# Altium schematic sheet 15-DDR4 DEVICES.SchDoc
size 513 x 386 mm
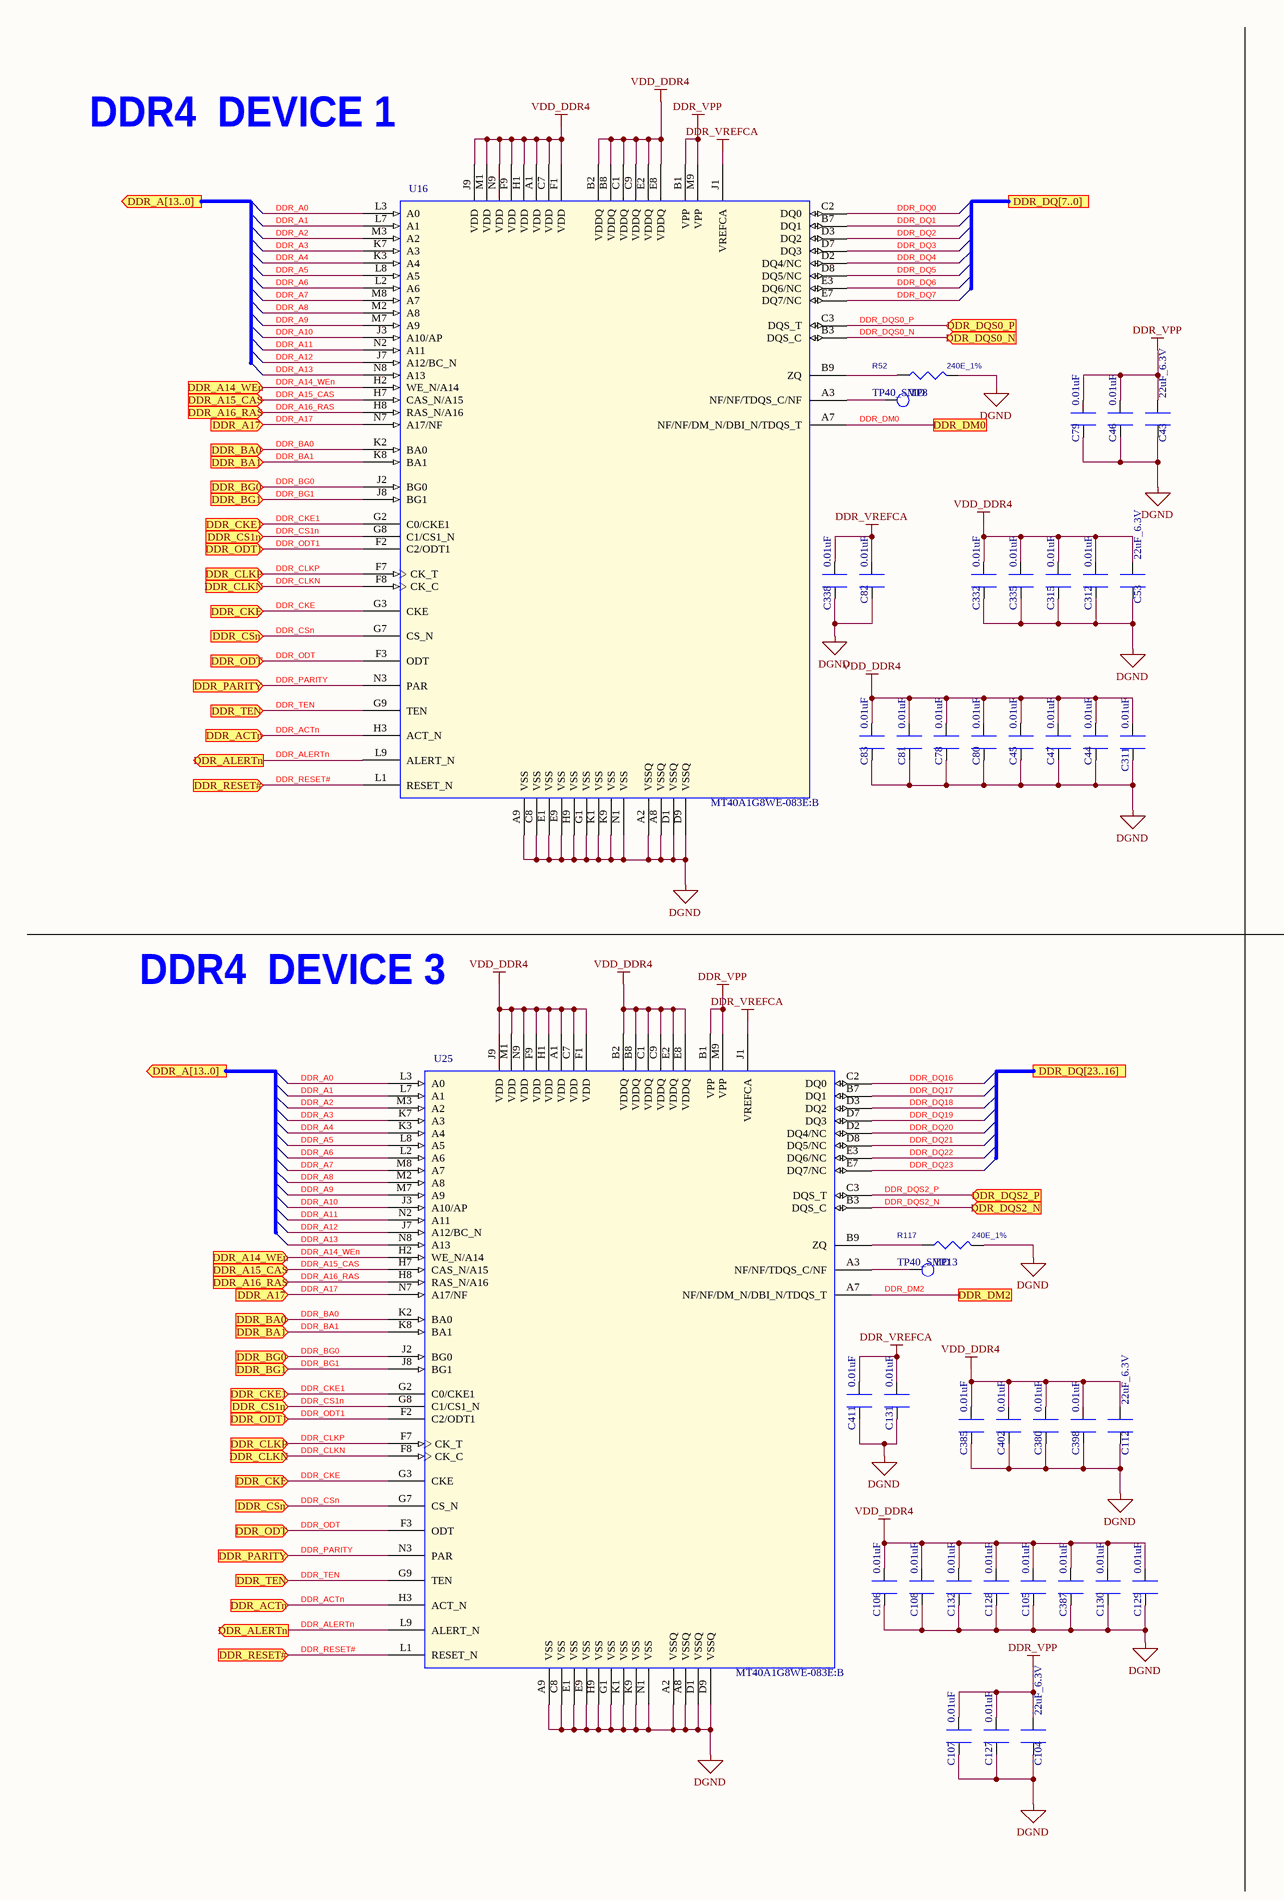
[diagram p0: 15-DDR4 DEVICES.SchDoc, left]
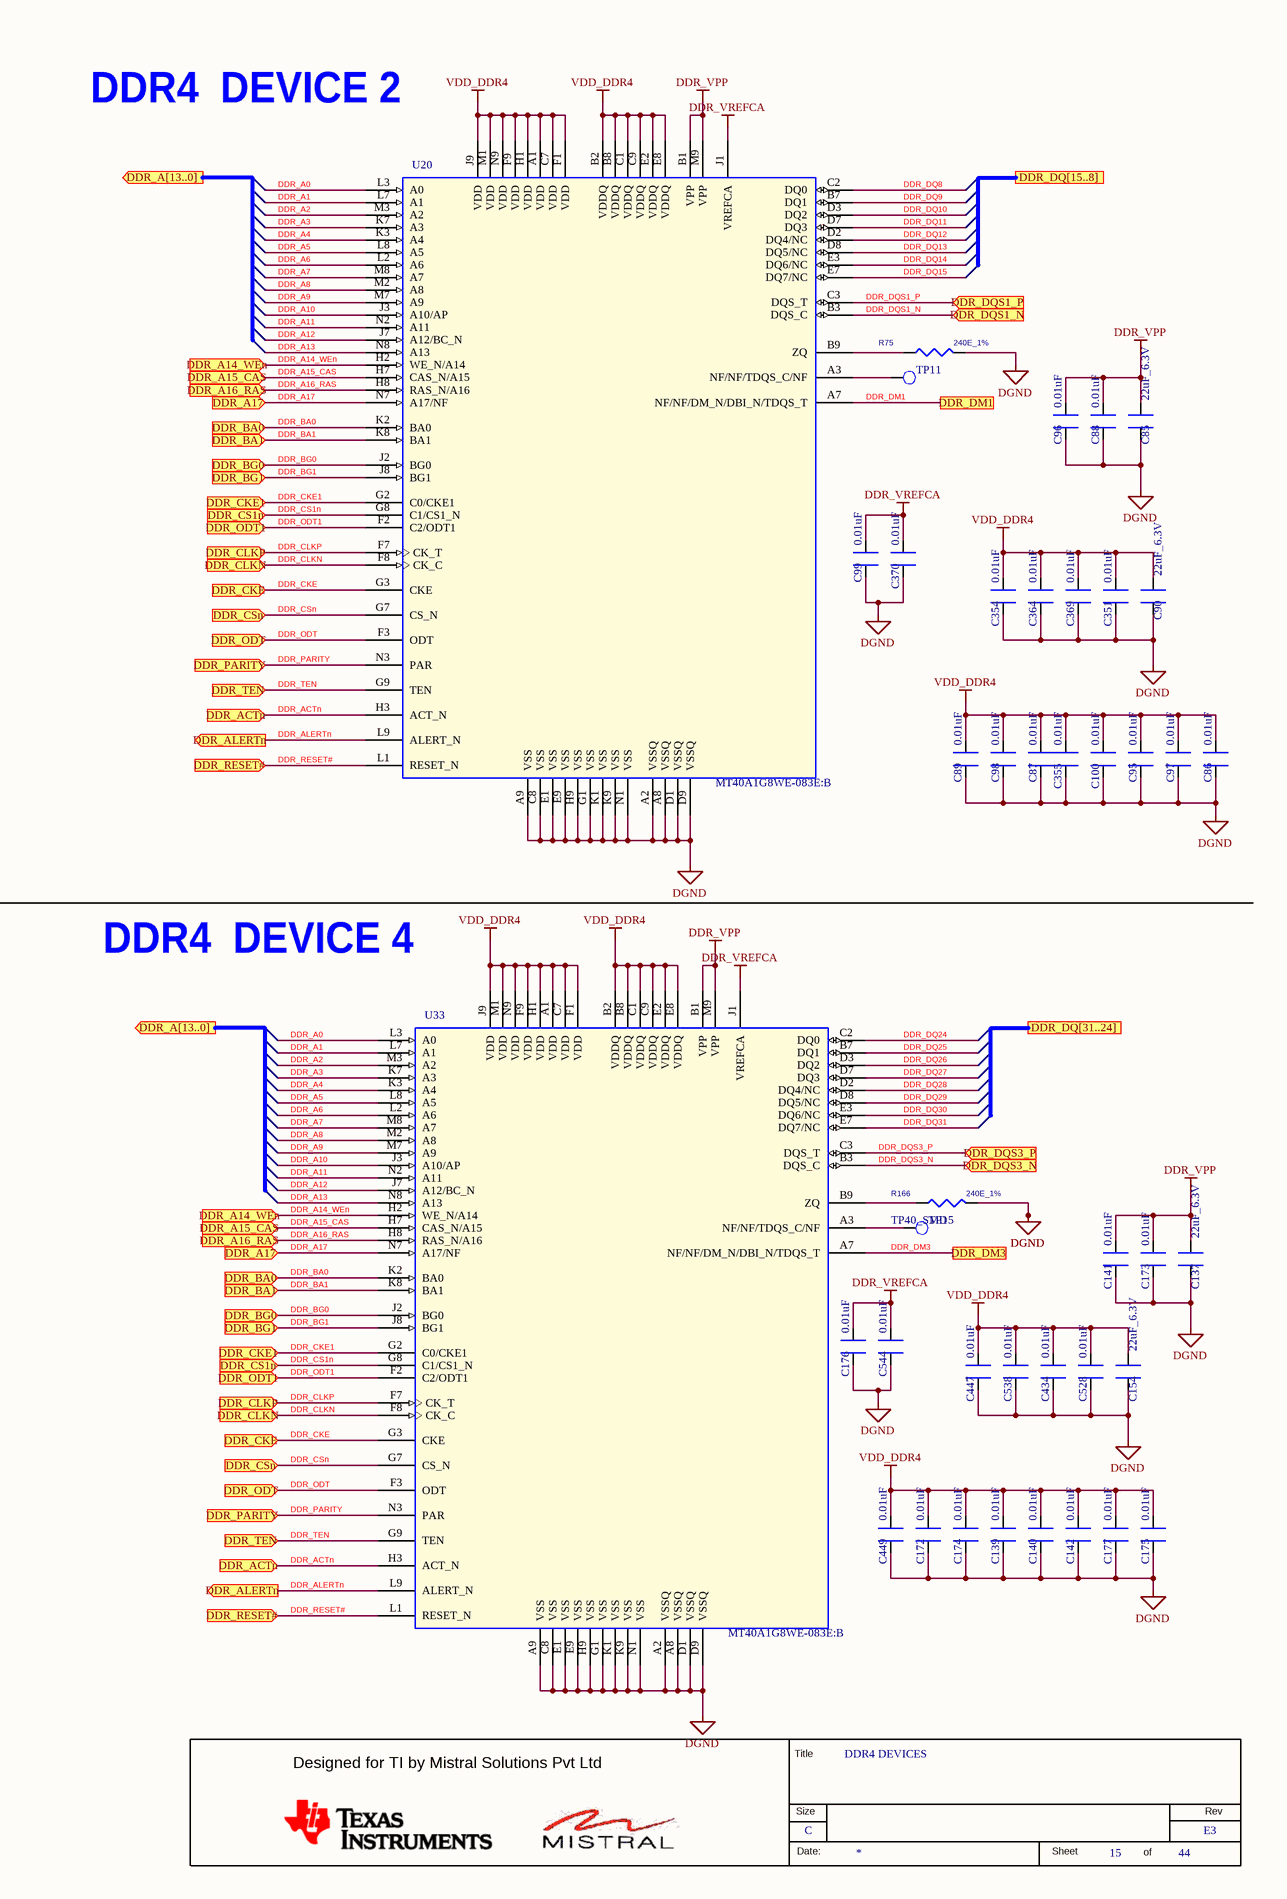
[diagram p1: 15-DDR4 DEVICES.SchDoc, right]

## Parts
*  RevCode: E3  Title: DDR4 DEVICES  Page Size: C  Page Number: 15  Page Count: 44  (hidden comment: MISTRAL_TITLEBLK_CSIZE)  (graphical)
C43  22uF_6.3V  [CAP0603]
C44  0.01uF  [CAP0201_0-5]
C45  0.01uF  [CAP0201_0-5]
C46  0.01uF  [CAP0201_0-5]
C47  0.01uF  [CAP0201_0-5]
C53  22uF_6.3V  [CAP0603]
C78  0.01uF  [CAP0201_0-5]
C79  0.01uF  [CAP0201_0-5]
C80  0.01uF  [CAP0201_0-5]
C81  0.01uF  [CAP0201_0-5]
C82  0.01uF  [CAP0201_0-5]
C83  0.01uF  [CAP0201_0-5]
C85  22uF_6.3V  [CAP0603]
C86  0.01uF  [CAP0201_0-5]
C87  0.01uF  [CAP0201_0-5]
C88  0.01uF  [CAP0201_0-5]
C89  0.01uF  [CAP0201_0-5]
C90  22uF_6.3V  [CAP0603]
C95  0.01uF  [CAP0201_0-5]
C96  0.01uF  [CAP0201_0-5]
C97  0.01uF  [CAP0201_0-5]
C98  0.01uF  [CAP0201_0-5]
C99  0.01uF  [CAP0201_0-5]
C100  0.01uF  [CAP0201_0-5]
C104  22uF_6.3V  [CAP0603]
C105  0.01uF  [CAP0201_0-5]
C106  0.01uF  [CAP0201_0-5]
C107  0.01uF  [CAP0201_0-5]
C108  0.01uF  [CAP0201_0-5]
C112  22uF_6.3V  [CAP0603]
C127  0.01uF  [CAP0201_0-5]
C128  0.01uF  [CAP0201_0-5]
C129  0.01uF  [CAP0201_0-5]
C130  0.01uF  [CAP0201_0-5]
C131  0.01uF  [CAP0201_0-5]
C132  0.01uF  [CAP0201_0-5]
C137  22uF_6.3V  [CAP0603]
C139  0.01uF  [CAP0201_0-5]
C140  0.01uF  [CAP0201_0-5]
C141  0.01uF  [CAP0201_0-5]
C142  0.01uF  [CAP0201_0-5]
C154  22uF_6.3V  [CAP0603]
C172  0.01uF  [CAP0201_0-5]
C173  0.01uF  [CAP0201_0-5]
C174  0.01uF  [CAP0201_0-5]
C175  0.01uF  [CAP0201_0-5]
C176  0.01uF  [CAP0201_0-5]
C177  0.01uF  [CAP0201_0-5]
C311  0.01uF  [CAP0201_0-5]
C312  0.01uF  [CAP0201_0-5]
C315  0.01uF  [CAP0201_0-5]
C332  0.01uF  [CAP0201_0-5]
C335  0.01uF  [CAP0201_0-5]
C338  0.01uF  [CAP0201_0-5]
C351  0.01uF  [CAP0201_0-5]
C354  0.01uF  [CAP0201_0-5]
C355  0.01uF  [CAP0201_0-5]
C364  0.01uF  [CAP0201_0-5]
C369  0.01uF  [CAP0201_0-5]
C370  0.01uF  [CAP0201_0-5]
C380  0.01uF  [CAP0201_0-5]
C385  0.01uF  [CAP0201_0-5]
C387  0.01uF  [CAP0201_0-5]
C398  0.01uF  [CAP0201_0-5]
C402  0.01uF  [CAP0201_0-5]
C411  0.01uF  [CAP0201_0-5]
C434  0.01uF  [CAP0201_0-5]
C447  0.01uF  [CAP0201_0-5]
C449  0.01uF  [CAP0201_0-5]
C528  0.01uF  [CAP0201_0-5]
C538  0.01uF  [CAP0201_0-5]
C544  0.01uF  [CAP0201_0-5]
R52  240E_1%  [RES0402]
R75  240E_1%  [RES0402]
R117  240E_1%  [RES0402]
R166  240E_1%  [RES0402]
TP8  TP40_SMD  [TP40_SMD]
TP11  TP40_SMD  [TP40_SMD]  (value not drawn)
TP13  TP40_SMD  [TP40_SMD]
TP15  TP40_SMD  [TP40_SMD]
U16  MT40A1G8WE-083E:B  [FBGA78_31-49_320X480_1-2]
U20  MT40A1G8WE-083E:B  [FBGA78_31-49_320X480_1-2]
U25  MT40A1G8WE-083E:B  [FBGA78_31-49_320X480_1-2]
U33  MT40A1G8WE-083E:B  [FBGA78_31-49_320X480_1-2]

## Ports
DDR_A14_WEn (in), DDR_A15_CAS (in), DDR_A16_RAS (in), DDR_A17 (in), DDR_A[13..0] (out), DDR_ACTn (in), DDR_ALERTn (out), DDR_BA0 (in), DDR_BA1 (in), DDR_BG0 (in), DDR_BG1 (in), DDR_CKE1 (in), DDR_CKE (in), DDR_CLKN (in), DDR_CLKP (in), DDR_CS1n (in), DDR_CSn (in), DDR_DM0, DDR_DM1, DDR_DM2, DDR_DM3, DDR_DQ[7..0], DDR_DQ[15..8], DDR_DQ[23..16], DDR_DQ[31..24], DDR_DQS0_N (in), DDR_DQS0_P (in), DDR_DQS1_N (in), DDR_DQS1_P (in), DDR_DQS2_N (in), DDR_DQS2_P (in), DDR_DQS3_N (in), DDR_DQS3_P (in), DDR_ODT1 (in), DDR_ODT (in), DDR_PARITY (in), DDR_RESET# (in), DDR_TEN (in)

## Nets
DDR_VPP: C43.1 C46.1 C79.1 C85.1 C88.1 C96.1 C104.1 C107.1 C127.1 C137.1 C141.1 C173.1 U16.B1(VPP) U16.M9(VPP) U20.B1(VPP) U20.M9(VPP) U25.B1(VPP) U25.M9(VPP) U33.B1(VPP) U33.M9(VPP)
DDR_VREFCA: C82.1 C99.1 C131.1 C176.1 C338.1 C370.1 C411.1 C544.1 U16.J1(VREFCA) U20.J1(VREFCA) U25.J1(VREFCA) U33.J1(VREFCA)
DGND: C43.2 C44.2 C45.2 C46.2 C47.2 C53.2 C78.2 C79.2 C80.2 C81.2 C82.2 C83.2 C85.2 C86.2 C87.2 C88.2 C89.2 C90.2 C95.2 C96.2 C97.2 C98.2 C99.2 C100.2 C104.2 C105.2 C106.2 C107.2 C108.2 C112.2 C127.2 C128.2 C129.2 C130.2 C131.2 C132.2 C137.2 C139.2 C140.2 C141.2 C142.2 C154.2 C172.2 C173.2 C174.2 C175.2 C176.2 C177.2 C311.2 C312.2 C315.2 C332.2 C335.2 C338.2 C351.2 C354.2 C355.2 C364.2 C369.2 C370.2 C380.2 C385.2 C387.2 C398.2 C402.2 C411.2 C434.2 C447.2 C449.2 C528.2 C538.2 C544.2 R52.2 R75.2 R117.2 R166.2 U16.A2(VSSQ) U16.A8(VSSQ) U16.A9(VSS) U16.C8(VSS) U16.D1(VSSQ) U16.D9(VSSQ) U16.E1(VSS) U16.E9(VSS) U16.G1(VSS) U16.H9(VSS) U16.K1(VSS) U16.K9(VSS) U16.N1(VSS) U20.A2(VSSQ) U20.A8(VSSQ) U20.A9(VSS) U20.C8(VSS) U20.D1(VSSQ) U20.D9(VSSQ) U20.E1(VSS) U20.E9(VSS) U20.G1(VSS) U20.H9(VSS) U20.K1(VSS) U20.K9(VSS) U20.N1(VSS) U25.A2(VSSQ) U25.A8(VSSQ) U25.A9(VSS) U25.C8(VSS) U25.D1(VSSQ) U25.D9(VSSQ) U25.E1(VSS) U25.E9(VSS) U25.G1(VSS) U25.H9(VSS) U25.K1(VSS) U25.K9(VSS) U25.N1(VSS) U33.A2(VSSQ) U33.A8(VSSQ) U33.A9(VSS) U33.C8(VSS) U33.D1(VSSQ) U33.D9(VSSQ) U33.E1(VSS) U33.E9(VSS) U33.G1(VSS) U33.H9(VSS) U33.K1(VSS) U33.K9(VSS) U33.N1(VSS)
VDD_DDR4: C44.1 C45.1 C47.1 C53.1 C78.1 C80.1 C81.1 C83.1 C86.1 C87.1 C89.1 C90.1 C95.1 C97.1 C98.1 C100.1 C105.1 C106.1 C108.1 C112.1 C128.1 C129.1 C130.1 C132.1 C139.1 C140.1 C142.1 C154.1 C172.1 C174.1 C175.1 C177.1 C311.1 C312.1 C315.1 C332.1 C335.1 C351.1 C354.1 C355.1 C364.1 C369.1 C380.1 C385.1 C387.1 C398.1 C402.1 C434.1 C447.1 C449.1 C528.1 C538.1 U16.A1(VDD) U16.B2(VDDQ) U16.B8(VDDQ) U16.C1(VDDQ) U16.C7(VDD) U16.C9(VDDQ) U16.E2(VDDQ) U16.E8(VDDQ) U16.F1(VDD) U16.F9(VDD) U16.H1(VDD) U16.J9(VDD) U16.M1(VDD) U16.N9(VDD) U20.A1(VDD) U20.B2(VDDQ) U20.B8(VDDQ) U20.C1(VDDQ) U20.C7(VDD) U20.C9(VDDQ) U20.E2(VDDQ) U20.E8(VDDQ) U20.F1(VDD) U20.F9(VDD) U20.H1(VDD) U20.J9(VDD) U20.M1(VDD) U20.N9(VDD) U25.A1(VDD) U25.B2(VDDQ) U25.B8(VDDQ) U25.C1(VDDQ) U25.C7(VDD) U25.C9(VDDQ) U25.E2(VDDQ) U25.E8(VDDQ) U25.F1(VDD) U25.F9(VDD) U25.H1(VDD) U25.J9(VDD) U25.M1(VDD) U25.N9(VDD) U33.A1(VDD) U33.B2(VDDQ) U33.B8(VDDQ) U33.C1(VDDQ) U33.C7(VDD) U33.C9(VDDQ) U33.E2(VDDQ) U33.E8(VDDQ) U33.F1(VDD) U33.F9(VDD) U33.H1(VDD) U33.J9(VDD) U33.M1(VDD) U33.N9(VDD)
DDR_A0: U16.L3(A0) U20.L3(A0) U25.L3(A0) U33.L3(A0)
DDR_A1: U16.L7(A1) U20.L7(A1) U25.L7(A1) U33.L7(A1)
DDR_A2: U16.M3(A2) U20.M3(A2) U25.M3(A2) U33.M3(A2)
DDR_A3: U16.K7(A3) U20.K7(A3) U25.K7(A3) U33.K7(A3)
DDR_A4: U16.K3(A4) U20.K3(A4) U25.K3(A4) U33.K3(A4)
DDR_A5: U16.L8(A5) U20.L8(A5) U25.L8(A5) U33.L8(A5)
DDR_A6: U16.L2(A6) U20.L2(A6) U25.L2(A6) U33.L2(A6)
DDR_A7: U16.M8(A7) U20.M8(A7) U25.M8(A7) U33.M8(A7)
DDR_A8: U16.M2(A8) U20.M2(A8) U25.M2(A8) U33.M2(A8)
DDR_A9: U16.M7(A9) U20.M7(A9) U25.M7(A9) U33.M7(A9)
DDR_A10: U16.J3(A10/AP) U20.J3(A10/AP) U25.J3(A10/AP) U33.J3(A10/AP)
DDR_A11: U16.N2(A11) U20.N2(A11) U25.N2(A11) U33.N2(A11)
DDR_A12: U16.J7(A12/BC_N) U20.J7(A12/BC_N) U25.J7(A12/BC_N) U33.J7(A12/BC_N)
DDR_A13: U16.N8(A13) U20.N8(A13) U25.N8(A13) U33.N8(A13)
DDR_A14_WEn: U16.H2(WE_N/A14) U20.H2(WE_N/A14) U25.H2(WE_N/A14) U33.H2(WE_N/A14) ; port DDR_A14_WEn
DDR_A15_CAS: U16.H7(CAS_N/A15) U20.H7(CAS_N/A15) U25.H7(CAS_N/A15) U33.H7(CAS_N/A15) ; port DDR_A15_CAS
DDR_A16_RAS: U16.H8(RAS_N/A16) U20.H8(RAS_N/A16) U25.H8(RAS_N/A16) U33.H8(RAS_N/A16) ; port DDR_A16_RAS
DDR_A17: U16.N7(A17/NF) U20.N7(A17/NF) U25.N7(A17/NF) U33.N7(A17/NF) ; port DDR_A17
DDR_ACTn: U16.H3(ACT_N) U20.H3(ACT_N) U25.H3(ACT_N) U33.H3(ACT_N) ; port DDR_ACTn
DDR_ALERTn: U16.L9(ALERT_N) U20.L9(ALERT_N) U25.L9(ALERT_N) U33.L9(ALERT_N) ; port DDR_ALERTn
DDR_BA0: U16.K2(BA0) U20.K2(BA0) U25.K2(BA0) U33.K2(BA0) ; port DDR_BA0
DDR_BA1: U16.K8(BA1) U20.K8(BA1) U25.K8(BA1) U33.K8(BA1) ; port DDR_BA1
DDR_BG0: U16.J2(BG0) U20.J2(BG0) U25.J2(BG0) U33.J2(BG0) ; port DDR_BG0
DDR_BG1: U16.J8(BG1) U20.J8(BG1) U25.J8(BG1) U33.J8(BG1) ; port DDR_BG1
DDR_CKE: U16.G3(CKE) U20.G3(CKE) U25.G3(CKE) U33.G3(CKE) ; port DDR_CKE
DDR_CKE1: U16.G2(C0/CKE1) U20.G2(C0/CKE1) U25.G2(C0/CKE1) U33.G2(C0/CKE1) ; port DDR_CKE1
DDR_CLKN: U16.F8(CK_C) U20.F8(CK_C) U25.F8(CK_C) U33.F8(CK_C) ; port DDR_CLKN
DDR_CLKP: U16.F7(CK_T) U20.F7(CK_T) U25.F7(CK_T) U33.F7(CK_T) ; port DDR_CLKP
DDR_CS1n: U16.G8(C1/CS1_N) U20.G8(C1/CS1_N) U25.G8(C1/CS1_N) U33.G8(C1/CS1_N) ; port DDR_CS1n
DDR_CSn: U16.G7(CS_N) U20.G7(CS_N) U25.G7(CS_N) U33.G7(CS_N) ; port DDR_CSn
DDR_DM0: U16.A7(NF/NF/DM_N/DBI_N/TDQS_T) ; port DDR_DM0
DDR_DM1: U20.A7(NF/NF/DM_N/DBI_N/TDQS_T) ; port DDR_DM1
DDR_DM2: U25.A7(NF/NF/DM_N/DBI_N/TDQS_T) ; port DDR_DM2
DDR_DM3: U33.A7(NF/NF/DM_N/DBI_N/TDQS_T) ; port DDR_DM3
DDR_DQ0: U16.C2(DQ0)
DDR_DQ1: U16.B7(DQ1)
DDR_DQ2: U16.D3(DQ2)
DDR_DQ3: U16.D7(DQ3)
DDR_DQ4: U16.D2(DQ4/NC)
DDR_DQ5: U16.D8(DQ5/NC)
DDR_DQ6: U16.E3(DQ6/NC)
DDR_DQ7: U16.E7(DQ7/NC)
DDR_DQ8: U20.C2(DQ0)
DDR_DQ9: U20.B7(DQ1)
DDR_DQ10: U20.D3(DQ2)
DDR_DQ11: U20.D7(DQ3)
DDR_DQ12: U20.D2(DQ4/NC)
DDR_DQ13: U20.D8(DQ5/NC)
DDR_DQ14: U20.E3(DQ6/NC)
DDR_DQ15: U20.E7(DQ7/NC)
DDR_DQ16: U25.C2(DQ0)
DDR_DQ17: U25.B7(DQ1)
DDR_DQ18: U25.D3(DQ2)
DDR_DQ19: U25.D7(DQ3)
DDR_DQ20: U25.D2(DQ4/NC)
DDR_DQ21: U25.D8(DQ5/NC)
DDR_DQ22: U25.E3(DQ6/NC)
DDR_DQ23: U25.E7(DQ7/NC)
DDR_DQ24: U33.C2(DQ0)
DDR_DQ25: U33.B7(DQ1)
DDR_DQ26: U33.D3(DQ2)
DDR_DQ27: U33.D7(DQ3)
DDR_DQ28: U33.D2(DQ4/NC)
DDR_DQ29: U33.D8(DQ5/NC)
DDR_DQ30: U33.E3(DQ6/NC)
DDR_DQ31: U33.E7(DQ7/NC)
DDR_DQS0_N: U16.B3(DQS_C) ; port DDR_DQS0_N
DDR_DQS0_P: U16.C3(DQS_T) ; port DDR_DQS0_P
DDR_DQS1_N: U20.B3(DQS_C) ; port DDR_DQS1_N
DDR_DQS1_P: U20.C3(DQS_T) ; port DDR_DQS1_P
DDR_DQS2_N: U25.B3(DQS_C) ; port DDR_DQS2_N
DDR_DQS2_P: U25.C3(DQS_T) ; port DDR_DQS2_P
DDR_DQS3_N: U33.B3(DQS_C) ; port DDR_DQS3_N
DDR_DQS3_P: U33.C3(DQS_T) ; port DDR_DQS3_P
DDR_ODT: U16.F3(ODT) U20.F3(ODT) U25.F3(ODT) U33.F3(ODT) ; port DDR_ODT
DDR_ODT1: U16.F2(C2/ODT1) U20.F2(C2/ODT1) U25.F2(C2/ODT1) U33.F2(C2/ODT1) ; port DDR_ODT1
DDR_PARITY: U16.N3(PAR) U20.N3(PAR) U25.N3(PAR) U33.N3(PAR) ; port DDR_PARITY
DDR_RESET#: U16.L1(RESET_N) U20.L1(RESET_N) U25.L1(RESET_N) U33.L1(RESET_N) ; port DDR_RESET#
DDR_TEN: U16.G9(TEN) U20.G9(TEN) U25.G9(TEN) U33.G9(TEN) ; port DDR_TEN
NetR52_1: R52.1 U16.B9(ZQ)
NetR75_1: R75.1 U20.B9(ZQ)
NetR117_1: R117.1 U25.B9(ZQ)
NetR166_1: R166.1 U33.B9(ZQ)
NetTP8_1: TP8.1(TP) U16.A3(NF/NF/TDQS_C/NF)
NetTP11_1: TP11.1(TP) U20.A3(NF/NF/TDQS_C/NF)
NetTP13_1: TP13.1(TP) U25.A3(NF/NF/TDQS_C/NF)
NetTP15_1: TP15.1(TP) U33.A3(NF/NF/TDQS_C/NF)

## Notes on the sheet
- DDR4  DEVICE 1
- DDR4  DEVICE 2
- DDR4  DEVICE 3
- DDR4  DEVICE 4
- (in symbol MISTRAL_TITLEBLK_CSIZE) Title; Designed for TI by Mistral Solutions Pvt Ltd; Size; Rev; Date:; Sheet; of

## Library data of the parts
* = MISTRAL_TITLEBLK_CSIZE: Issue: 1.0; Page Create Date: March  8, 1995; Page Modify Date: *
C43 C90 C112 C154 = CAP_Dup3: CAP CERAMIC 22uF 6.3V 20% X5R 0603; Alternate_mfr_part_number_A: CC0603MRX5R5BB226; Alternate_mfr_name_A: YAGEO AMERICA; Part_type: CAPACITORS\CERAMIC; Mfr_part_number: GRM188R60J226MEA0; Mfr_name: MURATA; Mistral Part No: 120015090007-R; Custom_Duty: 15%; Customs_HS_Code: 85322990; Wattage: NA; Project: OCTBTS_3000; Distributor_part_number_A: 311-1815-1-ND; Distributor_name_A: DIGIKEY; Library Ref: CAP; Chkd/date: JEBRAN/090915; Crtd /date: JEBRAN/090915; Datasheet: Y:\MIS_DATABASE\DATASHEETS\CAPACITORS\GRM188SERIES.PDF; Temperature: -55°C+85°C; Weight: NA; Height: 1.00MM; Distributor_part_number: 490-7611-2-ND; Distributor_name: DIGIKEY; Package: 0603; Voltage: 6.3V; Tolerance: 20%; PCB Footprint: CAP0603
C44-C47 C78-C81 C83 C87 C89 C95 C97 C98 C100 C105 C106 C108 C128 C130 C132 C139 C140 C142 C172 C174 C177 C311 C351 C354 C355 C364 C369 C380 C385 C387 C398 C402 C434 C447 C449 C528 C538 = CAP_Dup3: CAP CERAMIC 0.01uF 25V 10% X5R 0201; Mistral Part No: 120018010007-R; Mfr_name: MURATA; Mfr_part_number: GRM033R61E103KA12J; Part_type: CAPACITORS\CERAMIC; Wattage: NA; Project: TI_MAXIE_CPB; Customs_HS_Code: 85322990; Custom_Duty: 15%; Library Ref: CAP; MECHANICAL 3D STEP FILE: CAP0201_0-5; Temperature: -55°C+85°C; Weight: 0.33mg; PCB Footprint: CAP0201_0-5; Tolerance: 10%; Voltage: 25V; Package: 0201; Distributor_name: DIGIKEY; Distributor_part_number: GRM033R61E103KA12J-ND; Height: 0.33MM; Datasheet: Y:\MIS_DATABASE\DATASHEETS\CAPACITORS\GRM033R61E103KA12.PDF; Crtd /date: MANIRAJA/230118; Chkd/date: MANIRAJA/230118
C53 C104 C137 = CAP_Dup3: CAP CERAMIC 22uF 6.3V 20% X5R 0603; Alternate_mfr_part_number_A: CC0603MRX5R5BB226; Alternate_mfr_name_A: YAGEO AMERICA; Mistral Part No: 120015090007-R; Mfr_name: MURATA; Mfr_part_number: GRM188R60J226MEA0; Part_type: CAPACITORS\CERAMIC; Project: OCTBTS_3000; Wattage: NA; Customs_HS_Code: 85322990; Custom_Duty: 15%; Distributor_part_number_A: 311-1815-1-ND; Distributor_name_A: DIGIKEY; Library Ref: CAP; Tolerance: 20%; Voltage: 6.3V; Package: 0603; Distributor_name: DIGIKEY; Distributor_part_number: 490-7611-2-ND; Height: 1.00MM; Weight: NA; Temperature: -55°C+85°C; Datasheet: Y:\MIS_DATABASE\DATASHEETS\CAPACITORS\GRM188SERIES.PDF; Crtd /date: JEBRAN/090915; Chkd/date: JEBRAN/090915; PCB Footprint: CAP0603
C82 C86 C88 C96 C99 C107 C127 C129 C131 C141 C173 C175 C176 C312 C315 C332 C335 C338 C370 C411 C544 = CAP_Dup3: CAP CERAMIC 0.01uF 25V 10% X5R 0201; Part_type: CAPACITORS\CERAMIC; Mfr_part_number: GRM033R61E103KA12J; Mfr_name: MURATA; Mistral Part No: 120018010007-R; Wattage: NA; Custom_Duty: 15%; Customs_HS_Code: 85322990; Project: TI_MAXIE_CPB; Library Ref: CAP; MECHANICAL 3D STEP FILE: CAP0201_0-5; Temperature: -55°C+85°C; Weight: 0.33mg; PCB Footprint: CAP0201_0-5; Chkd/date: MANIRAJA/230118; Crtd /date: MANIRAJA/230118; Datasheet: Y:\MIS_DATABASE\DATASHEETS\CAPACITORS\GRM033R61E103KA12.PDF; Height: 0.33MM; Distributor_part_number: GRM033R61E103KA12J-ND; Distributor_name: DIGIKEY; Package: 0201; Voltage: 25V; Tolerance: 10%
C85 = CAP_Dup3: CAP CERAMIC 22uF 6.3V 20% X5R 0603; Part_type: CAPACITORS\CERAMIC; Mfr_part_number: GRM188R60J226MEA0; Mfr_name: MURATA; Mistral Part No: 120015090007-R; Alternate_mfr_name_A: YAGEO AMERICA; Alternate_mfr_part_number_A: CC0603MRX5R5BB226; Custom_Duty: 15%; Customs_HS_Code: 85322990; Wattage: NA; Project: OCTBTS_3000; Chkd/date: JEBRAN/090915; Crtd /date: JEBRAN/090915; Datasheet: Y:\MIS_DATABASE\DATASHEETS\CAPACITORS\GRM188SERIES.PDF; Temperature: -55°C+85°C; Weight: NA; Height: 1.00MM; Distributor_part_number: 490-7611-2-ND; Distributor_name: DIGIKEY; Package: 0603; Voltage: 6.3V; Tolerance: 20%; Library Ref: CAP; Distributor_name_A: DIGIKEY; Distributor_part_number_A: 311-1815-1-ND; PCB Footprint: CAP0603
R52 R75 = RESISTOR_Dup1: RES 240E 1/10W 1% 0402; Part_type: RESISTORS\FIXED; Mfr_part_number: ERJ-2RKF2400X; Mfr_name: PANASONIC-ECG; Mistral Part No: 110011060017-R; Custom_Duty: 15%; Customs_HS_Code: 85332119; Voltage: NA; Project: AM4515_EVM_LCD; Library Ref: RESISTOR; Chkd/date: MAZHAR/150611; Crtd /date: BAVISH/020611; Datasheet: Y:\MIS_DATABASE\DATASHEETS\RESISTORS\ERJ-2R.PDF; Temperature: -55°C+125°C; Weight: 0.8/1000g; Height: 0.40MM; Distributor_part_number: P240LCT-ND; Distributor_name: DIGIKEY; Package: 0402; Wattage: 1/10W; Tolerance: 1%; PCB Footprint: RES0402
R117 R166 = RESISTOR_Dup1: RES 240E 1/10W 1% 0402; Mistral Part No: 110011060017-R; Mfr_name: PANASONIC-ECG; Mfr_part_number: ERJ-2RKF2400X; Part_type: RESISTORS\FIXED; Project: AM4515_EVM_LCD; Voltage: NA; Customs_HS_Code: 85332119; Custom_Duty: 15%; Library Ref: RESISTOR; Tolerance: 1%; Wattage: 1/10W; Package: 0402; Distributor_name: DIGIKEY; Distributor_part_number: P240LCT-ND; Height: 0.40MM; Weight: 0.8/1000g; Temperature: -55°C+125°C; Datasheet: Y:\MIS_DATABASE\DATASHEETS\RESISTORS\ERJ-2R.PDF; Crtd /date: BAVISH/020611; Chkd/date: MAZHAR/150611; PCB Footprint: RES0402
TP8 TP13 TP15 = TESTPOINT: TESTPOINT CIR 40 SMD; Mistral Part No: 130009030933; Mfr_name: LOCAL; MECHANICAL 3D STEP FILE: NA; Project: RAINIER-3; NI_MARK: DNI; RoHS: NA; Footprint Ref: TP40_SMD; Library Ref: TESTPOINT; Footprint Path: Y:\MIS_DATABASE\Library\ALTIUM_TOOL\PCB_FOOTPRINTS\Altium_Footprint_Lib.PcbLib; Library Path: Y:\MIS_DATABASE\Library\ALTIUM_TOOL\SCHEMATICS_PARTS\MS_DISCRETE_Library.schlib; Datasheet: NA; Temperature: NA; Weight: NA; Wattage: NA; Voltage: NA; Tolerance: NA; Mfr_part_number: TP40_SMD; Part_type: TESTPOINT; Package: SMD; Distributor_name: NA; Distributor_part_number: NA; Height: NA; Crtd /date: MAZHAR/190505; Chkd/date: MAZHAR/190505; PCB Footprint: TP40_SMD
TP11 = TESTPOINT: TESTPOINT CIR 40 SMD; Mfr_name: LOCAL; Mistral Part No: 130009030933; Project: RAINIER-3; Tolerance: NA; NI_MARK: DNI; Chkd/date: MAZHAR/190505; Crtd /date: MAZHAR/190505; Height: NA; Distributor_part_number: NA; Distributor_name: NA; Package: SMD; Part_type: TESTPOINT; Mfr_part_number: TP40_SMD; Voltage: NA; Wattage: NA; Weight: NA; Temperature: NA; Datasheet: NA; MECHANICAL 3D STEP FILE: NA; Library Path: Y:\MIS_DATABASE\Library\ALTIUM_TOOL\SCHEMATICS_PARTS\MS_DISCRETE_Library.schlib; Footprint Path: Y:\MIS_DATABASE\Library\ALTIUM_TOOL\PCB_FOOTPRINTS\Altium_Footprint_Lib.PcbLib; Library Ref: TESTPOINT; Footprint Ref: TP40_SMD; RoHS: NA; PCB Footprint: TP40_SMD
U16 U20 = MT40A1G8WE-083_FBGA78: IC 1G8 DDR4 SDRAM MEMORY FBGA78; Part_type: ICS\DIGITAL\MEMORY; Mfr_name: MICRON; Mistral Part No: 141117080006-R; Custom_Duty: 15%; Customs_HS_Code: 85423100; Wattage: NA; Project: TI_MAXIE_CPB; Library Ref: MT40A1G8WE-083_FBGA78; MECHANICAL 3D STEP FILE: FBGA78_31-49_320X480_1-2; Chkd/date: MANIRAJA/220817; Crtd /date: MANIRAJA/220817; Datasheet: Y:\MIS_DATABASE\DATASHEETS\ICS\MEMORY\MT40AXX.PDF; Temperature: 0°C+95°C; Weight: NA; Height: 1.20MM; Distributor_part_number: 557-1727-1-ND; Distributor_name: DIGIKEY; Package: FBGA78; Voltage: NA; Tolerance: NA; Mfr_part_number: MT40A1G8WE-083E:B; PCB Footprint: FBGA78_31-49_320X480_1-2
U25 U33 = MT40A1G8WE-083_FBGA78: IC 1G8 DDR4 SDRAM MEMORY FBGA78; Mistral Part No: 141117080006-R; Mfr_name: MICRON; Part_type: ICS\DIGITAL\MEMORY; Project: TI_MAXIE_CPB; Tolerance: NA; Customs_HS_Code: 85423100; Custom_Duty: 15%; Library Ref: MT40A1G8WE-083_FBGA78; Mfr_part_number: MT40A1G8WE-083E:B; Voltage: NA; Wattage: NA; Package: FBGA78; Distributor_name: DIGIKEY; Distributor_part_number: 557-1727-1-ND; Height: 1.20MM; Weight: NA; Temperature: 0°C+95°C; Datasheet: Y:\MIS_DATABASE\DATASHEETS\ICS\MEMORY\MT40AXX.PDF; Crtd /date: MANIRAJA/220817; Chkd/date: MANIRAJA/220817; MECHANICAL 3D STEP FILE: FBGA78_31-49_320X480_1-2; PCB Footprint: FBGA78_31-49_320X480_1-2